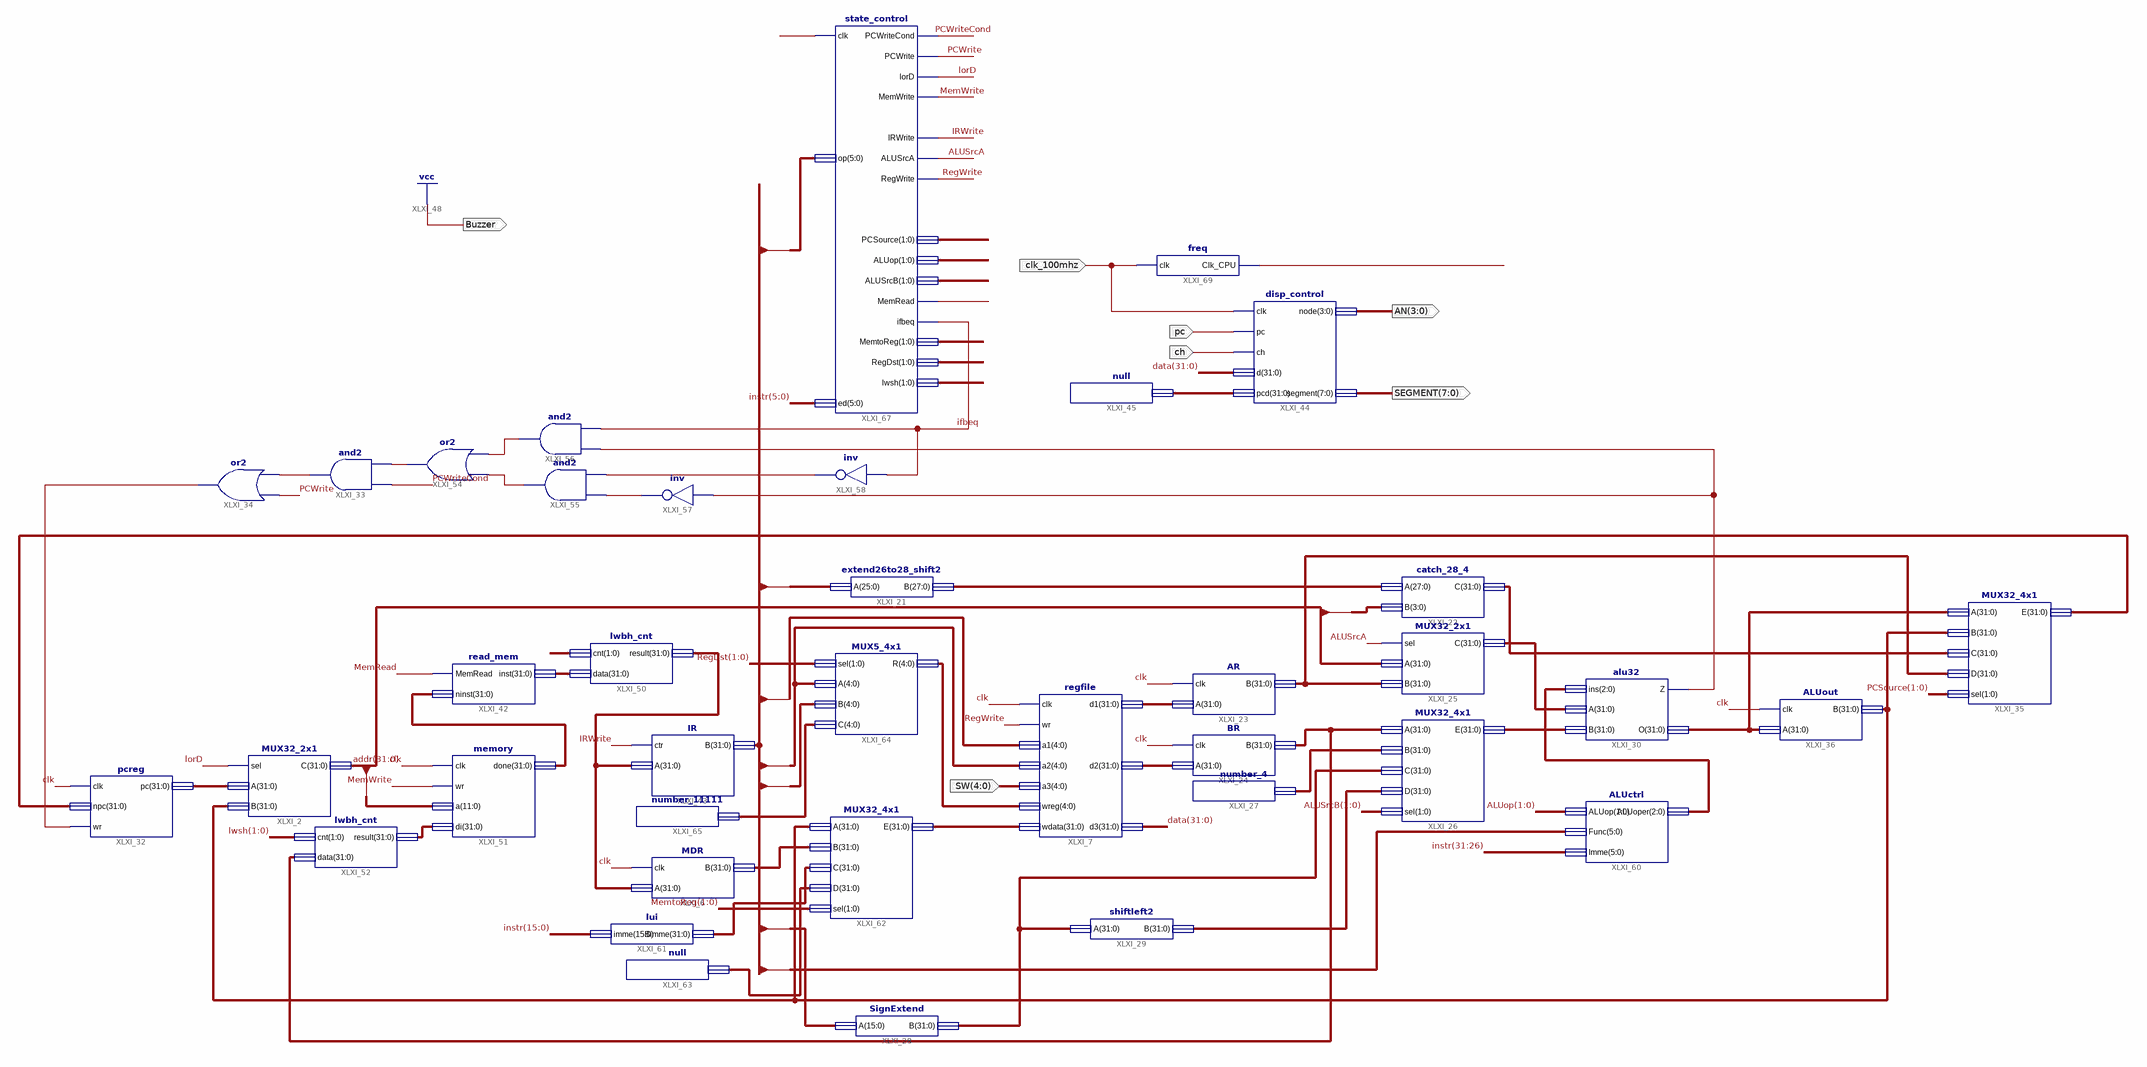
[diagram p0: schematic sheet 1]
// Xilinx ISE schematic top_for_multy_CPU.sch (kintex7) as structural Verilog: 38 symbols, 7 ports
module top_for_multy_CPU (
  input  [4:0] SW,
  input  ch,
  input  pc,
  input  clk_100mhz,
  output [3:0] AN,
  output [7:0] SEGMENT,
  output Buzzer
);

  wire ALUSrcA, clk, ifbeq, IRWrite, lorD, MemRead, MemWrite, PCWrite, PCWriteCond, RegWrite, XLXN_64,
       XLXN_68, XLXN_124, XLXN_125, XLXN_126, XLXN_128, XLXN_129, XLXN_130;
  wire [1:0] ALUop, ALUSrcB, lwsh, MemtoReg, PCSource, RegDst;
  wire [2:0] XLXN_59;
  wire [4:0] XLXN_34, XLXN_140;
  wire [27:0] XLXN_42;
  wire [31:0] addr, data, instr, XLXN_1, XLXN_31, XLXN_32, XLXN_44, XLXN_45, XLXN_48, XLXN_52, XLXN_55,
       XLXN_56, XLXN_57, XLXN_58, XLXN_69, XLXN_70, XLXN_71, XLXN_76, XLXN_104, XLXN_105, XLXN_112, XLXN_115,
       XLXN_117, XLXN_119, XLXN_136, XLXN_138;

  MDR XLXI_6 (.clk(clk), .A(XLXN_117), .B(XLXN_31));
  regfile XLXI_7 (
    .clk(clk), .wr(RegWrite), .a1(instr[25:21]), .a2(instr[20:16]), .a3(SW), .wreg(XLXN_34), .wdata(XLXN_32),
    .d1(XLXN_44), .d2(XLXN_45), .d3(data));
  MUX32_2x1 XLXI_2 (.sel(lorD), .A(XLXN_1), .B(XLXN_71), .C(addr));
  extend26to28_shift2 XLXI_21 (.A(instr[25:0]), .B(XLXN_42));
  catch_28_4 XLXI_22 (.A(XLXN_42), .B(addr[31:28]), .C(XLXN_70));
  AR XLXI_23 (.clk(clk), .A(XLXN_44), .B(XLXN_48));
  BR XLXI_24 (.clk(clk), .A(XLXN_45), .B(XLXN_104));
  MUX32_2x1 XLXI_25 (.sel(ALUSrcA), .A(addr), .B(XLXN_48), .C(XLXN_58));
  MUX32_4x1 XLXI_26 (.A(XLXN_104), .B(XLXN_52), .C(XLXN_55), .D(XLXN_56), .sel(ALUSrcB), .E(XLXN_57));
  number_4 XLXI_27 (.num(XLXN_52));
  SignExtend XLXI_28 (.A(instr[15:0]), .B(XLXN_55));
  shiftleft2 XLXI_29 (.A(XLXN_55), .B(XLXN_56));
  alu32 XLXI_30 (.ins(XLXN_59), .A(XLXN_58), .B(XLXN_57), .Z(XLXN_130), .O(XLXN_69));
  pcreg XLXI_32 (.clk(clk), .npc(XLXN_76), .pc(XLXN_1), .wr(XLXN_68));
  and XLXI_33 (XLXN_64, XLXN_124, PCWriteCond);
  or XLXI_34 (XLXN_68, XLXN_64, PCWrite);
  MUX32_4x1 XLXI_35 (.A(XLXN_69), .B(XLXN_71), .C(XLXN_70), .D(XLXN_48), .sel(PCSource), .E(XLXN_76));
  ALUout XLXI_36 (.clk(clk), .A(XLXN_69), .B(XLXN_71));
  read_mem XLXI_42 (.MemRead(MemRead), .ninst(XLXN_105), .inst(XLXN_115));
  IR XLXI_43 (.ctr(IRWrite), .A(XLXN_117), .B(instr));
  disp_control XLXI_44 (.clk(clk_100mhz), .pc(pc), .ch(ch), .d(data), .pcd(XLXN_112), .node(AN), .segment(SEGMENT));
  \null  XLXI_45 (.A(XLXN_112));
  lwbh_cnt XLXI_50 (.cnt(lwsh), .data(XLXN_115), .result(XLXN_117));
  memory XLXI_51 (.clk(clk), .wr(MemWrite), .a(addr[11:0]), .di(XLXN_119), .done(XLXN_105));
  lwbh_cnt XLXI_52 (.cnt(lwsh), .data(XLXN_104), .result(XLXN_119));
  or XLXI_54 (XLXN_124, XLXN_125, XLXN_126);
  and XLXI_55 (XLXN_126, XLXN_129, XLXN_128);
  and XLXI_56 (XLXN_125, ifbeq, XLXN_130);
  not XLXI_57 (XLXN_128, XLXN_130);
  not XLXI_58 (XLXN_129, ifbeq);
  ALUctrl XLXI_60 (.ALUop(ALUop), .Func(instr[5:0]), .Imme(instr[31:26]), .ALUoper(XLXN_59));
  lui XLXI_61 (.imme(instr[15:0]), .Bimme(XLXN_136));
  MUX32_4x1 XLXI_62 (.A(XLXN_71), .B(XLXN_31), .C(XLXN_136), .D(XLXN_138), .sel(MemtoReg), .E(XLXN_32));
  \null  XLXI_63 (.A(XLXN_138));
  MUX5_4x1 XLXI_64 (.sel(RegDst), .A(instr[20:16]), .B(instr[15:11]), .C(XLXN_140), .R(XLXN_34));
  number_11111 XLXI_65 (.A(XLXN_140));
  state_control XLXI_67 (
    .clk(clk), .op(instr[31:26]), .PCWriteCond(PCWriteCond), .PCWrite(PCWrite), .lorD(lorD),
    .MemWrite(MemWrite), .IRWrite(IRWrite), .ALUSrcA(ALUSrcA), .RegWrite(RegWrite), .MemRead(MemRead),
    .ifbeq(ifbeq), .MemtoReg(MemtoReg), .PCSource(PCSource), .ALUop(ALUop), .ALUSrcB(ALUSrcB),
    .RegDst(RegDst), .lwsh(lwsh), .ed(instr[5:0]));
  freq XLXI_69 (.clk(clk_100mhz), .Clk_CPU(clk));

  assign Buzzer = 1'b1;
endmodule
